# Altium schematic sheet LCD.SchDoc: LCD & keyboard
size 420 x 297 mm; Author: G.Kasprowicz; CompanyName: WUT ISE; DrawnBy: G.Kasprowicz; Organization: WUT ISE; Address1: PW ISE; Address2: Nowowiejska 15/19 00-665 Warsaw; Address3: gkasprow@gmail.com; DocumentNumber: 8; Revision: 2; SheetNumber: 8; SheetTotal: 18; ModifiedBy: -; CheckedDate: -; Title2: Connector; DivGrp: WUT ISE; Designer: G.Kasprowicz; ModifiedDate: -; ProjectName: Sensor Box
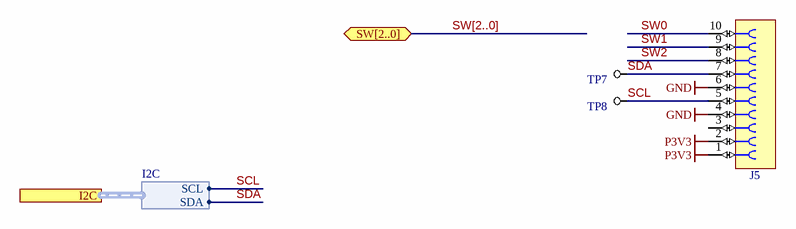
[diagram p0: LCD.SchDoc]

## Parts
J5  FFC  [WURTH_686 110 144 22]  (value not drawn)
TP7  TP  [TP]  (value not drawn)
TP8  TP  [TP]  (value not drawn)

## Ports
I2C (harness I2C), SW[2..0] (bidir)

## Harnesses
I2C: SCL, SDA

## Nets
GND: J5.4 J5.6
P3V3: J5.1 J5.2
SCL: J5.5 TP8.1 ; port I2C.SCL
SDA: J5.7 TP7.1 ; port I2C.SDA
SW0: J5.10
SW1: J5.9
SW2: J5.8

Not connected (* = marked no-connect by the designer): J5 3

## Buses and harness runs
bus SW[2..0] = port SW[2..0]

## Notes on the sheet
- Project/Equipment
- Document
- Designer
- Drawn by
- Check.by
- Copyright WUT ISE 2020.
  This documentation describes Open Hardware and is licensed under the CERN OHL v.1.2. You may redistribute and modify this documentation under the terms of the CERN OHL v.1.2. (http://ohwr.org/CERNOHL). This documentation is distributed WITHOUT ANY EXPRESS OR IMPLIED WARRANTY, INCLUDING OF MERCHANTABILITY, SATISFACTORY QUALITY AND FITNESS FOR A PARTICULAR PURPOSE. Please see the CERN OHL v.1.2 for applicable conditions.
- Contact
- File
- Last Mod.
- Print Date
- Sheet
- Size
- A3
- of
- Rev

## Library data of the parts
J5 = WURTH_686 110 144 22: Connector 10 Female; Part Description: 10 Contacts, Pitch 1mm, SMT Connector, ZIF Horizontal Bottom Contact WR-FPC; Manufacturer: WURTH ELEKTRONIK; PressFit: No; Part Number: WURTH_686 110 144 22; Component Kind: Standard; Component Type: Standard; Pin Count: 10; Family: FFC; Mounted: Yes; Socket: No; SMD: Yes; Sense: No; Status: None; Manufacturer Part Number: 686 110 144 22; ComponentHeight: 3.15mm; HelpURL: \\cern.ch\dfs\Applications\Altium\Datasheets\WURTH_686 110 144 22.pdf; Author: CERN DEM JMW; CreateDate: 06.08.2015; LatestRevisionDate: 06.08.2015
TP7 TP8 = TP: Testpoint